# Altium schematic sheet Smartfin Main PCBA USB.SchDoc: USB
size Tabloid; TOCFontName: Consolas; TOCFontSize: 24; TOCFontColor: 0; TOCFontAttributes: 0; TOCMaxLinesInTable: 25; TOCVerticalOffset: 200; TOCHorizontalOffset: 500; TOCHorizontalSeparation: 800; TOCVerticalSeparation: 30; TOCHorizTableSize: 640; Engineer: Amy Domino; DocumentNumber: 644-001-023; Revision: A; SheetNumber: 7; SheetTotal: 9; PageSetup: Record=PageOptions|CenterHorizontal=True|CenterVertical=True|PrintScale=0.96|XCorrection=1.00|YCorrection=1.00|PrintKind=0|BorderSize=5000000|LeftOffset=0|BottomOffset=0|Orientation=2|PaperLength=1000|PaperWidth=1000|Scale=100|PaperSource=7|PrintQuality=-4|MediaType=1|DitherType=10|PaperKind=11" x 17"|PrintScaleMode=1
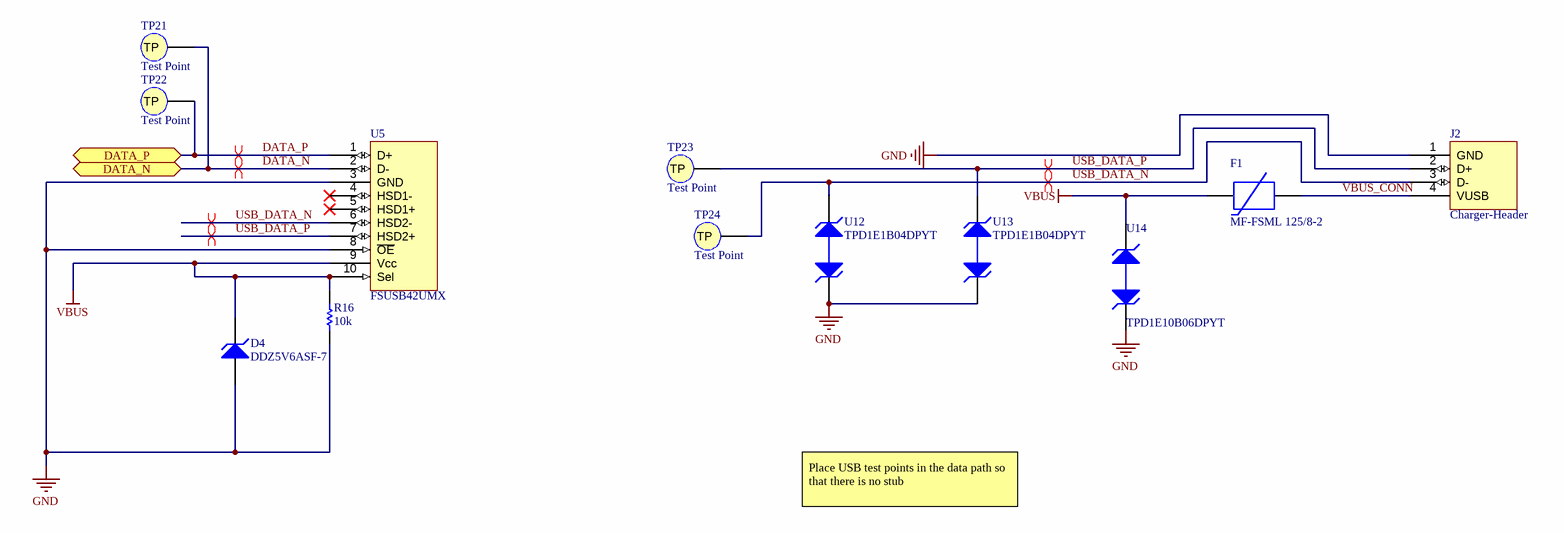
[diagram p0: Smartfin Main PCBA USB.SchDoc]

## Parts
D4  DDZ5V6ASF-7  [SOD323F]
F1  MF-FSML 125/8-2  [MF-FSMF010X-2-Footprint-1]
J2  Charger-Header  [New footprint 1]  (no BOM)
R16  10k  [RESC0402(1005)_N]
TP21  Test Point  [TESTPAD_ICT]  (no BOM)
TP22  Test Point  [TESTPAD_ICT]  (no BOM)
TP23  Test Point  [TESTPAD_ICT]  (no BOM)
TP24  Test Point  [TESTPAD_ICT]  (no BOM)
U5  FSUSB42UMX  [FSUSB42UMX-Footprint-1]
U12  TPD1E1B04DPYT  [TPD1E10B06DPYT-Footprint-1]
U13  TPD1E1B04DPYT  [TPD1E10B06DPYT-Footprint-1]
U14  TPD1E10B06DPYT  [TPD1E10B06DPYT-Footprint-1]

## Ports
DATA_N (bidir), DATA_P (bidir)

## Nets
GND: D4.A J2.1(GND) R16.1 U5.3(GND) U5.8(~{OE}) U12.1 U13.2 U14.2
VBUS: D4.K F1.2 R16.2 U5.9(Vcc) U5.10(Sel) U14.1
DATA_N: TP21.1(TP) U5.2(D-) ; port DATA_N
DATA_P: TP22.1(TP) U5.1(D+) ; port DATA_P
USB_DATA_N: J2.3(D-) TP24.1(TP) U5.6(HSD2-) U12.2
USB_DATA_P: J2.2(D+) TP23.1(TP) U5.7(HSD2+) U13.1
VBUS_CONN: F1.1 J2.4(VUSB)

Not connected (* = marked no-connect by the designer): U5 4(HSD1-)* 5(HSD1+)*

## Layout directives
differential pair: DATA_N, DATA_P, USB_DATA_N, USB_DATA_P

## Notes on the sheet
- Place USB test points in the data path so that there is no stub
- TITLE
- DOC NUMBER
- VARIANT
- REV
- 10875 dover st, suite 500
  westminster, co, 80021, usa
  syncroness.com
- FILE
- ENGINEER
- SHEET
- DATE
- OF
- THIS DOCUMENT IS CONFIDENTIAL AND THE PROPERTY OF SYNCRONESS, INC. AND ITS SUBSIDARIES. IT SHALL NOT BE REPRODUCED IN ANY MANNER NOR USED FOR ANY PURPOSE WHATSOEVER EXCEPT AS SPECIFIED IN WRITING BY SYNCRONESS, INC.

## Library data of the parts
D4 = CMP-16992-A.4: DIODE ZENER 5.42V 200MW SOD-323; Manufacturer: Diodes Inc.; Current - Reverse Leakage @ Vr: 7.5uA @ 2V; Impedance (Max) (Zzt): 80 Ohm; Voltage - Zener (Nom) (Vz): 5.42; Power - Max: 500mW; Tolerance: ±3%; Voltage - Forward (Vf) (Max) @ If: 900mV @ 10mA; Supplier Part Number 1: DDZ5V6ASF-7DICT-ND; Category: Discrete Semiconductor Products; Mounting Type: Surface Mount; Operating Temperature: -65°C ~ 150°C; Package / Case: SC-90, SOD-323F; Packaging: Cut Tape (CT); RoHS: RoHS Compliant; Supplier 1: Digi-Key; Supplier Device Package: SOD-323F; Manufacturer Part Number: DDZ5V6ASF-7
F1 = CMP-23709-A.6: 0603 SMD POLYMER PTC 1.25A/8V; Manufacturer: Bourns; Max Current Rating: 50A; Resistance: 0.02; Operating Supply Voltage: 8V; Power Dissipation: 500mW; Hold Current: 100mA; Trip Current: 2500mA; Time to Trip: 3s; Approvals: UL,TUV; Mount: Surface Mount; Case/Package: 0603; Case Code (Metric): 1608; Case Code (Imperial): 0603; Number of Terminals: 2; Terminal Material: Gold; Min Operating Temperature: -40°C; Max Operating Temperature: 85°C; Package Quantity: 5000; Packaging: Tape and Reel; Voltage Rating: 8V; Termination: SMD/SMT; Voltage Rating (DC): 8V; Length: 1.65mm; Height: 0.7mm; Width: 0.85mm; Radiation Hardening: No; REACH SVHC: No SVHC; Lead Free: Lead Free; Manufacturer Part Number: MF-FSML 125/8-2; Supplier: DIgikey; Supplier Part Number: MF-FSML125/8-2CT-ND
J2 = CMP-23701-A.5: usb power connection
R16 = CMP-15831-A.1: RES SMD 10K OHM 0.1% 1/16W 0402; Manufacturer: Panasonic Electronic Components; Manufacturer Part Number: ERA-2ARB103X; Power (Watts): 0.063W, 1/16W; Temperature Coefficient: ±10ppm/°C; Packaging: Cut Tape (CT); Part Status: Active; Resistance (Ohms): 10k; Tolerance: ±0.1%; Composition: Thin Film; Features: Automotive AEC-Q200; Operating Temperature: -55°C ~ 155°C; Package / Case: 0402 (1005 Metric); Supplier Device Package: 0402; Size / Dimension: 0.039" L x 0.020" W (1.00mm x 0.50mm); Height - Seated (Max): 0.016" (0.40mm); Failure Rate: -; Supplier: Digi-Key; Supplier Part Number: P10KCPCT-ND; ComponentLink1Description: Datasheet; ComponentLink1URL: https://industrial.panasonic.com/cdbs/www-data/pdf/RDM0000/AOA0000C237.pdf
TP21-TP24 = CMP-08242-A.3: ICT Test Point
U5 = CMP-23705-A.6: USB MULTIMEDIA SWITCHES; Manufacturer: On Semiconductor; Number of Inputs: 2; Number of Channels: 1; Min Supply Voltage: 3V; Max Supply Voltage: 4.3V; Data Rate: 480Mbps; Output Current: 100mA; Propagation Delay: 0.25ns; Bandwidth: 720MHz; Nominal Supply Current: 1uA; Turn-Off Delay Time: 25ns; On-State Resistance: 6.5R; Turn-On Delay Time: 30ns; Throw Configuration: DPDT; Supply Type: Single; Mount: Surface Mount; Number of Pins: 10; Weight: 18.08g; Min Operating Temperature: -40°C; Max Operating Temperature: 85°C; Number of Outputs: 2; Packaging: Tape and Reel; Operating Supply Voltage: 4.3V; Package Quantity: 1; Number of Ports: 2; Termination: SMD/SMT; Length: 1.4mm; Height: 0.5mm; Width: 1.8mm; Radiation Hardening: No; REACH SVHC: No SVHC; Lead Free: Lead Free; Manufacturer Part Number: FSUSB42UMX; Datasheet: https://www.onsemi.com/pub/Collateral/FSUSB42-D.PDF; Supplier: Digi-Key; Supplier Part Number: FSUSB42UMXCT-ND
U12 U13 = CMP-23707-A.9: TVS DIODE 3.6V 8.5V 2X1SON; Manufacturer: Texas Instruments; Capacitance: 1pF; Interface: LVDS,USB,Ethernet; Number of Channels: 1; Min Operating Temperature: -40°C; Max Operating Temperature: 125°C; Lead Free: Lead Free; Manufacturer Part Number: TPD1E1B04DPYT; Supplier: Digi-Key; Supplier Part Number: 296-47364-1-ND; ComponentLink1Description: datasheet; ComponentLink1URL: https://www.ti.com/lit/ds/symlink/tpd1e1b04.pdf
U14 = CMP-23708-A.6: TVS DIODE 5.5VWM 14VC 2X2SON; Manufacturer: Texas Instruments; Direction: Bidirectional; Number of Channels: 1; Peak Pulse Current: 5A; Breakdown Voltage: 6V; Interface: GPIO; Capacitance: 12pF; Reverse Standoff Voltage: 5.5V; Clamping Voltage: 14V; Peak Pulse Power: 90W; Power Line Protection: No; Leakage Current: 100nA; Element Configuration: Single; Case/Package: 0402; Number of Pins: 2; Min Operating Temperature: -40°C; Max Operating Temperature: 125°C; Composition: Zener; Length: 1.1mm; Radiation Hardening: No; Lead Free: Lead Free; Packaging: Tape and Reel; Package Quantity: 250; Number of Bidirectional Channels: 1; Min Breakdown Voltage: 6V; Polarity: Bidirectional; Working Voltage: 5.5V; Max Power Dissipation: 90W; Manufacturer Part Number: TPD1E10B06DPYT; Supplier: Digi-Key; Supplier Part Number: 296-41842-1-ND